# Altium schematic sheet 01_Index.SchDoc
size A4; SheetNumber: 1; SheetTotal: 5
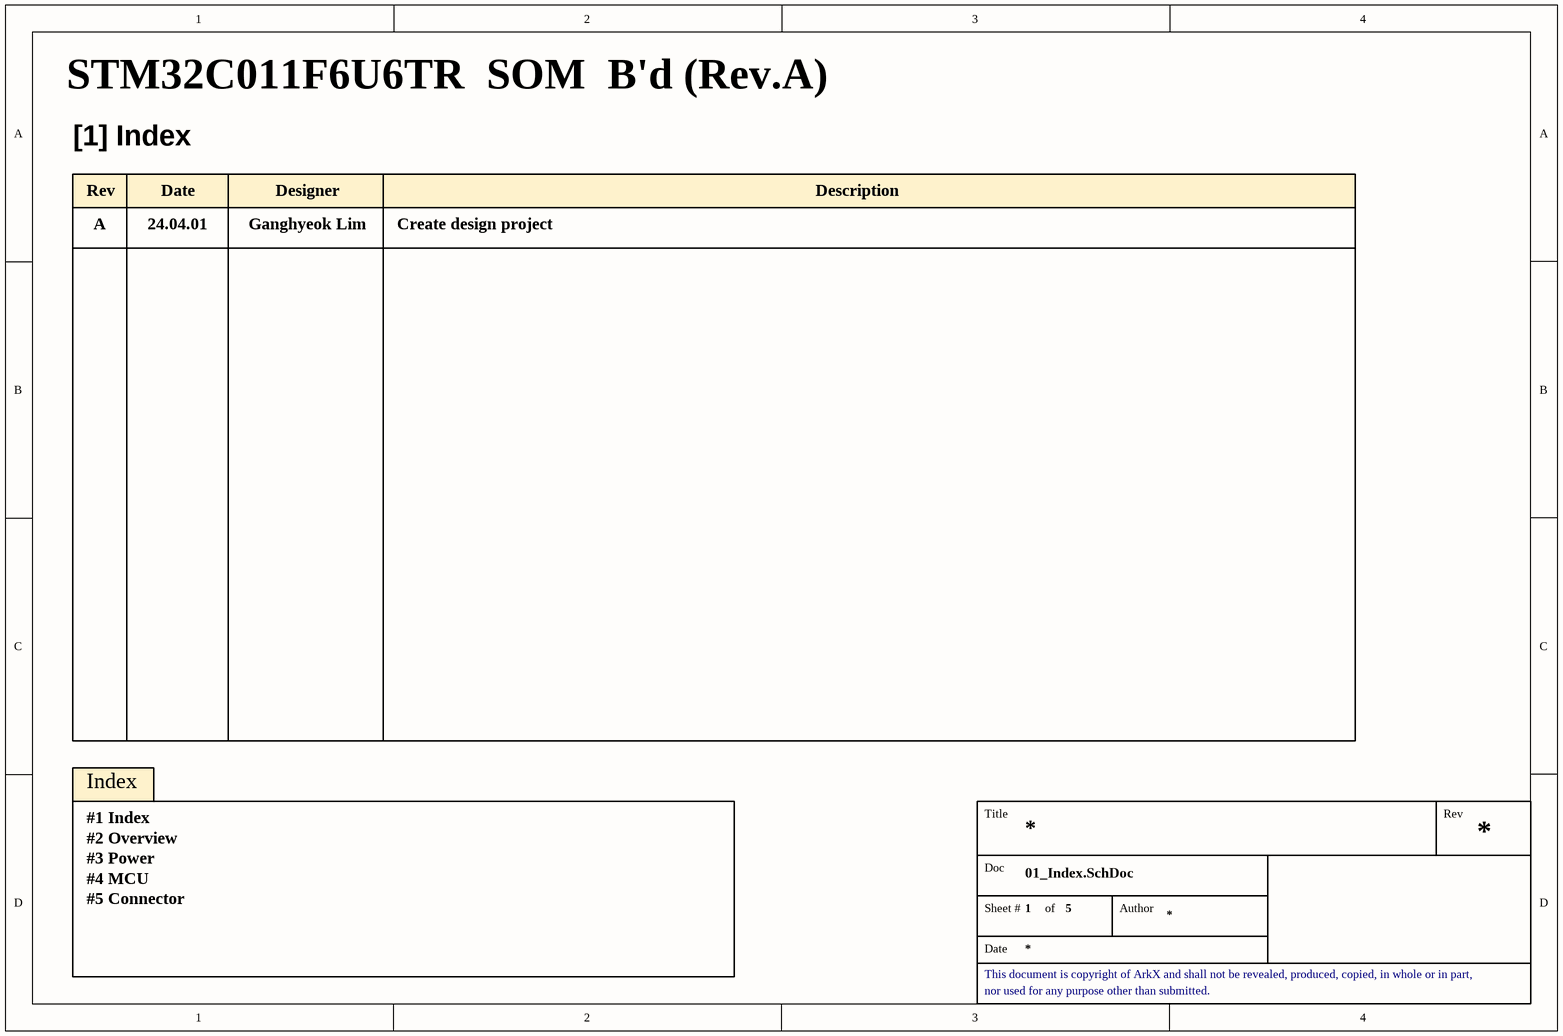
[diagram p0: 01_Index.SchDoc]

## Notes on the sheet
- STM32C011F6U6TR  SOM  B'd (Rev.A)
- [1] Index
- Rev
- A
- 24.04.01
- Date
- Ganghyeok Lim
- Designer
- Create design project
- Description
- Index
- #1 Index
- #2 Overview
- #3 Power
- #4 MCU
- #5 Connector
- Title
- Doc
- Sheet #
- of
- Author
- This document is copyright of ArkX and shall not be revealed, produced, copied, in whole or in part,
- nor used for any purpose other than submitted.